# Altium schematic sheet Sensors_AFE1.schdoc: FR sensors
size 420 x 297 mm; EDA_Number: ARTIQ; Projet: KASLI 3U subsystem; CheckedBy: MK; Author: G.K.; CompanyName: CREOTECH; DrawnBy: G.K.; Organization: CTI SA; Address1: Creotech Instruments SA; Address2: Okulickiego 7/9, 05-500 Poland; Revision: -; SheetNumber: -; SheetTotal: -; ModifiedBy: -; CreateDate: XX/XX/XXXX; CheckedDate: -; DivGrp: CTI; Designer: G.K.; ModifiedDate: -; ProjectName: FMC DAC 100M 14B 16CHA ADC 2M 14B 4CHA
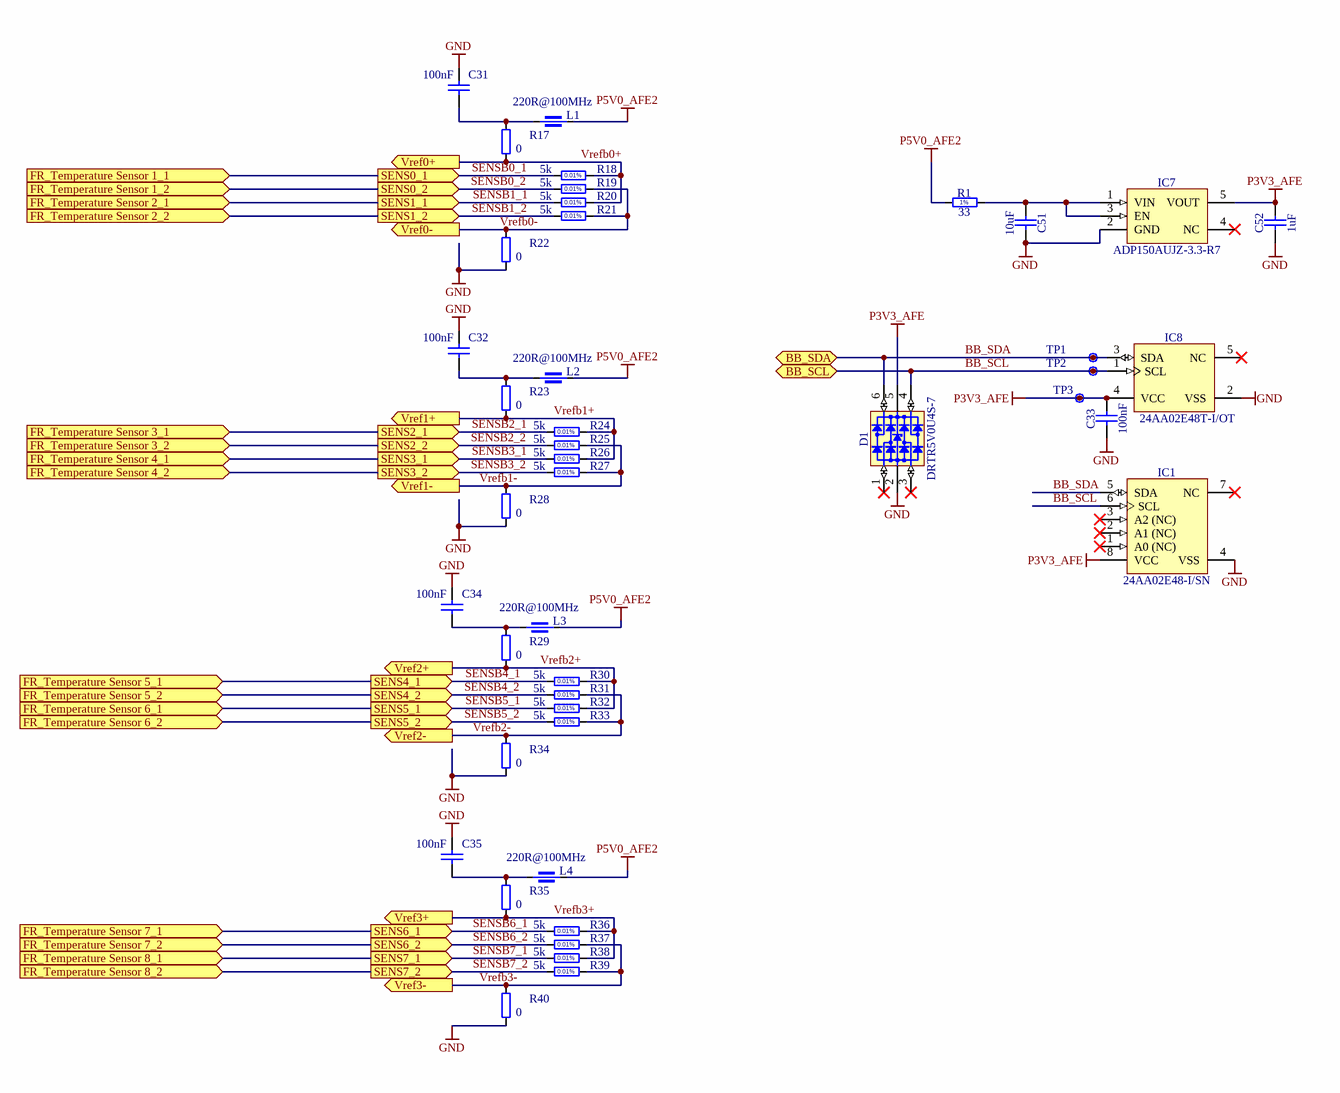
[diagram p0: Sensors_AFE1.schdoc]

## Parts
C31  100nF  [CAPC1005X55N]
C32  100nF  [CAPC1005X55N]
C33  100nF  [CAPC1005X55N]
C34  100nF  [CAPC1005X55N]
C35  100nF  [CAPC1005X55N]
C51  10uF  [CAPC2012X135N]
C52  1uF  [CAPC1608X87N]
D1  DRTR5V0U4S-7  [SOT65P210X110-6N]
IC1  24AA02E48-I/SN  [SOIC127P600X175-8N]
IC7  ADP150AUJZ-3.3-R7  [SOT95P280X90-5N]
IC8  24AA02E48T-I/OT  [SOT95P280X145-5N]
L1  220R@100MHz  [INDC1005X55N]
L2  220R@100MHz  [INDC1005X55N]
L3  220R@100MHz  [INDC1005X55N]
L4  220R@100MHz  [INDC1005X55N]
R1  33  [RESC1005X40N]
R17  0  [RESC1608X55N]
R18  5k  [RESC2013X64N]
R19  5k  [RESC2013X64N]
R20  5k  [RESC2013X64N]
R21  5k  [RESC2013X64N]
R22  0  [RESC1608X55N]
R23  0  [RESC1608X55N]
R24  5k  [RESC2013X64N]
R25  5k  [RESC2013X64N]
R26  5k  [RESC2013X64N]
R27  5k  [RESC2013X64N]
R28  0  [RESC1608X55N]
R29  0  [RESC1608X55N]
R30  5k  [RESC2013X64N]
R31  5k  [RESC2013X64N]
R32  5k  [RESC2013X64N]
R33  5k  [RESC2013X64N]
R34  0  [RESC1608X55N]
R35  0  [RESC1608X55N]
R36  5k  [RESC2013X64N]
R37  5k  [RESC2013X64N]
R38  5k  [RESC2013X64N]
R39  5k  [RESC2013X64N]
R40  0  [RESC1608X55N]
TP1  Test Point  [TPS127]  (value not drawn)
TP2  Test Point  [TPS127]  (value not drawn)
TP3  Test Point  [TPS127]  (value not drawn)

## Ports
BB_SCL (bidir), BB_SDA (bidir), FR_Temperature Sensor 1_1 (in), FR_Temperature Sensor 1_2 (in), FR_Temperature Sensor 2_1 (in), FR_Temperature Sensor 2_2 (in), FR_Temperature Sensor 3_1 (in), FR_Temperature Sensor 3_2 (in), FR_Temperature Sensor 4_1 (in), FR_Temperature Sensor 4_2 (in), FR_Temperature Sensor 5_1 (in), FR_Temperature Sensor 5_2 (in), FR_Temperature Sensor 6_1 (in), FR_Temperature Sensor 6_2 (in), FR_Temperature Sensor 7_1 (in), FR_Temperature Sensor 7_2 (in), FR_Temperature Sensor 8_1 (in), FR_Temperature Sensor 8_2 (in), SENS0_1 (out), SENS0_2 (out), SENS1_1 (out), SENS1_2 (out), SENS2_1 (out), SENS2_2 (out), SENS3_1 (out), SENS3_2 (out), SENS4_1 (out), SENS4_2 (out), SENS5_1 (out), SENS5_2 (out), SENS6_1 (out), SENS6_2 (out), SENS7_1 (out), SENS7_2 (out), Vref0+ (out), Vref0- (out), Vref1+ (out), Vref1- (out), Vref2+ (out), Vref2- (out), Vref3+ (out), Vref3- (out)

## Nets
GND: C31.1 C32.1 C33.1 C34.1 C35.1 C51.2 C52.1 D1.2(GND) IC1.4(VSS) IC7.2(GND) IC8.2(VSS) R22.1 R28.1 R34.1 R40.1
P3V3_AFE: C33.2 C52.2 D1.5(VBUS) IC1.8(VCC) IC7.5(VOUT) IC8.4(VCC) TP3.1
P5V0_AFE2: L1.2 L2.2 L3.2 L4.2 R1.1
BB_SCL: D1.4(I/O3) IC1.6(SCL) IC8.1(SCL) TP2.1 ; port BB_SCL
BB_SDA: D1.6(I/O4) IC1.5(SDA) IC8.3(SDA) TP1.1 ; port BB_SDA
SENSB0_1: R18.1 ; port SENS0_1, port FR_Temperature Sensor 1_1
SENSB0_2: R19.1 ; port SENS0_2, port FR_Temperature Sensor 1_2
SENSB1_1: R20.1 ; port SENS1_1, port FR_Temperature Sensor 2_1
SENSB1_2: R21.1 ; port SENS1_2, port FR_Temperature Sensor 2_2
SENSB2_1: R24.1 ; port SENS2_1, port FR_Temperature Sensor 3_1
SENSB2_2: R25.1 ; port SENS2_2, port FR_Temperature Sensor 3_2
SENSB3_1: R26.1 ; port SENS3_1, port FR_Temperature Sensor 4_1
SENSB3_2: R27.1 ; port SENS3_2, port FR_Temperature Sensor 4_2
SENSB4_1: R30.1 ; port SENS4_1, port FR_Temperature Sensor 5_1
SENSB4_2: R31.1 ; port SENS4_2, port FR_Temperature Sensor 5_2
SENSB5_1: R32.1 ; port SENS5_1, port FR_Temperature Sensor 6_1
SENSB5_2: R33.1 ; port SENS5_2, port FR_Temperature Sensor 6_2
SENSB6_1: R36.1 ; port SENS6_1, port FR_Temperature Sensor 7_1
SENSB6_2: R37.1 ; port SENS6_2, port FR_Temperature Sensor 7_2
SENSB7_1: R38.1 ; port SENS7_1, port FR_Temperature Sensor 8_1
SENSB7_2: R39.1 ; port SENS7_2, port FR_Temperature Sensor 8_2
Vrefb0+: R17.1 R18.2 R20.2 ; port Vref0+
Vrefb0-: R19.2 R21.2 R22.2 ; port Vref0-
Vrefb1+: R23.1 R24.2 R26.2 ; port Vref1+
Vrefb1-: R25.2 R27.2 R28.2 ; port Vref1-
Vrefb2+: R29.1 R30.2 R32.2 ; port Vref2+
Vrefb2-: R31.2 R33.2 R34.2 ; port Vref2-
Vrefb3+: R35.1 R36.2 R38.2 ; port Vref3+
Vrefb3-: R37.2 R39.2 R40.2 ; port Vref3-
NetC31_2: C31.2 L1.1 R17.2
NetC32_2: C32.2 L2.1 R23.2
NetC34_2: C34.2 L3.1 R29.2
NetC35_2: C35.2 L4.1 R35.2
NetC51_1: C51.1 IC7.1(VIN) IC7.3(EN) R1.2

Not connected (* = marked no-connect by the designer): D1 1(I/O1)* 3(I/O2)*; IC1 1(A0_(NC))* 2(A1_(NC))* 3(A2_(NC))* 7(NC)*; IC7 4(NC)*; IC8 5(NC)*

## Notes on the sheet
- Project/Equipment
- Document
- Designer
- Drawn by
- Check.by
- Copyright Creotech Instruments SA 2014.
  This documentation describes Open Hardware and is licensed under the CERN OHL v.1.1. You may redistribute and modify this documentation under the terms of the CERN OHL v.1.1. (http://ohwr.org/CERNOHL). This documentation is distributed WITHOUT ANY EXPRESS OR IMPLIED WARRANTY, INCLUDING OF MERCHANTABILITY, SATISFACTORY QUALITY AND FITNESS FOR A PARTICULAR PURPOSE. Please see the CERN OHL v.1.1 for applicable conditions.
- File
- Last Mod.
- Print Date
- Sheet
- Size
- A3
- of
- Rev
- (in symbol R0402_33R_1%_0.0625W_100PPM) 1%
- (in symbol R0805_5K_0.01%_0.2W_0.2PPM_VISHAY_VSMP) 0.01%

## Library data of the parts
C31-C35 = CC0402_100NF_16V_10%_X5R: Non-polarised capacitor; Part Description: SMD Multilayer Chip Ceramic Capacitor; Manufacturer: GENERIC; Manufacturer1 Part Number: GRM155R61C104KA88D; Voltage: 16V; TC: X5R; Tolerance: ±10%; Part Number: CC0402_100NF_16V_10%_X5R; Component Kind: Standard; Component Type: Standard; Pin Count: 2; Value: 100nF; Status: None; Manufacturer Part Number: CC0402_100NF_16V_10%_X5R; Case: 0402; Mounted: Yes; Socket: No; SMD: Yes; Sense: No; Manufacturer1 Example: MURATA; Manufacturer1 ComponentHeight: 0.55mm; HelpURL: \\cern.ch\dfs\Applications\Altium\Datasheets\CC0402_X5R_MURATA_GRM.pdf; Author: CERN DEM JLC; CreateDate: 10.12.2013; LatestRevisionDate: 10.12.2013
C51 = CC0805_10UF_16V_10%_X5R: Non-polarised capacitor; Part Description: SMD Multilayer Chip Ceramic Capacitor; Manufacturer: GENERIC; Manufacturer1 Part Number: C0805C106K4PAC; Voltage: 16V; TC: X5R; Tolerance: ±10%; Part Number: CC0805_10UF_16V_10%_X5R; Component Kind: Standard; Component Type: Standard; Pin Count: 2; Value: 10uF; Status: Preferred; Manufacturer Part Number: CC0805_10UF_16V_10%_X5R; Case: 0805; Mounted: Yes; Socket: No; SMD: Yes; Manufacturer1 Example: KEMET; Manufacturer1 ComponentHeight: 1.4mm; HelpURL: \\cern.ch\dfs\Applications\Altium\Datasheets\CC1206_X5R_KEMET.pdf; Author: CERN DEM JLC; CreateDate: 03.12.2007; LatestRevisionDate: 03.12.2007; Sense: No
C52 = CC0603_1UF_25V_10%_X7R: Non-polarised capacitor; Part Description: SMD Multilayer Chip Ceramic Capacitor; Manufacturer: GENERIC; Manufacturer1 Part Number: GRM188R71E105KA12D; Voltage: 25V; TC: X7R; Tolerance: ±10%; Part Number: CC0603_1UF_25V_10%_X7R; Component Kind: Standard; Component Type: Standard; Pin Count: 2; Value: 1uF; Status: None; Manufacturer Part Number: CC0603_1UF_25V_10%_X7R; Case: 0603; Mounted: Yes; Socket: No; SMD: Yes; Sense: No; Manufacturer1 Example: MURATA; Manufacturer1 ComponentHeight: 0.9mm; HelpURL: \\cern.ch\dfs\Applications\Altium\Datasheets\CC0603_X7R_MURATA.pdf; Author: CERN DEM JLC; CreateDate: 18/01/2011; LatestRevisionDate: 18/01/2011
D1 = D_TVS_DRTR5V0U4S-7: Integrated Quad Ultra-Low Capacitance ESD Protection; Part Description: Integrated Quad Ultra-Low Capacitance ESD (±8kV) Protection; Manufacturer: DIODES; PressFit: No; Bonding: No; Status Comment: Active; Part Number: DRTR5V0U4S-7; Component Kind: Standard; Component Type: Standard; Device: DRTR5V0U4S-7; PackageDescription: SOT363, SC70-6, 0.65mm Pitch; 6 Pin, 1.25mm W X 2.00mm L X 1.10mm H body, IPC Medium Density; Status: Active; Manufacturer Part Number: DRTR5V0U4S-7; Pin Count: 6; Case: SOT363; Mounted: Yes; Socket: No; SMD: Yes; Sense: No; ComponentHeight: 1.1mm; HelpURL: \\cern.ch\dfs\Applications\Altium\Datasheets\PRTR5V0U4Y.pdf; Author: GK; CreateDate: 24.01.2017; LatestRevisionDate: 14.09.2020
IC1 = MEM_24AA02E48-I/SN: 1.7V-5.5V, 2K I2C™ Serial EEPROMs with EUI-48™ Node Identity; Manufacturer: MICROCHIP TECHNOLOGY; PressFit: No; Bonding: No; Part Number: 24AA02E48-I/SN; Component Kind: Standard; Component Type: Standard; Device: 24AA02E48-I/SN; PackageDescription: SOIC, 1.27mm Pitch; 8 Pin - Body 4x5mm, IPC Medium Density; Part Description: 1.7V-5.5V, 2K I2C™ Serial EEPROMs with EUI-48™ Node Identity; Manufacturer Part Number: 24AA02E48-I/SN; Pin Count: 8; Case: SOIC8; Mounted: Yes; Socket: No; SMD: Yes; Sense: No; ComponentHeight: 1.75mm; HelpURL: \\cern.ch\dfs\Applications\Altium\Datasheets\24AA025E48-I-SN.pdf; Author: CERN DEM MR; CreateDate: 19.07.2016; LatestRevisionDate: 19.07.2016
IC7 = ADP150AUJZ-3.3-R7: Ultralow Noise, 150 mA CMOS Linear Regulator; Part Description: 3.3V, 150mA, Ultralow Noise, CMOS Linear Regulator; Manufacturer: ANALOG DEVICES; PressFit: No; Bonding: No; Part Number: ADP150AUJZ-3.3-R7; Component Kind: Standard; Component Type: Standard; Device: ADP150AUJZ-3.3-R7; PackageDescription: SOT23, 0.95mm pitch; 5 pin, 1.75mm W X 3.00mm L, IPC Medium Density; Manufacturer Part Number: ADP150AUJZ-3.3-R7; Pin Count: 5; Case: SOT23; Mounted: Yes; Socket: No; SMD: Yes; Sense: No; ComponentHeight: 0.9mm; HelpURL: \\cern.ch\dfs\Applications\Altium\Datasheets\ADP150AUJZ-3.3-R7.pdf; Author: CERN DEM JLC; CreateDate: 27/09/2011; LatestRevisionDate: 19/06/2014
IC8 = 24AA02E48T-I/OT: 1.7V-5.5V, 2K I2C Serial EEPROM With EUI-48 Node Identity; Manufacturer: MICROCHIP TECHNOLOGY; PressFit: No; Bonding: No; Part Number: 24AA02E48T-I/OT; Component Kind: Standard; Component Type: Standard; Device: 24AA02E48T-I/OT; PackageDescription: SOT, 0.95mm pitch; 5 pin, 1.60mm W X 2.90mm L X 1.45mm H body, IPC Medium Density; Part Description: 1.7V-5.5V, 2K I2C Serial EEPROM With EUI-48 Node Identity; Manufacturer Part Number: 24AA02E48T-I/OT; Pin Count: 5; Case: SOT23-5; Mounted: Yes; Socket: No; SMD: Yes; Sense: No; ComponentHeight: 1.45mm; HelpURL: \\cern.ch\dfs\Applications\Altium\Datasheets\24AA02E48T-I-OT.pdf; Author: CERN DEM MR; CreateDate: 31.03.2016; LatestRevisionDate: 31.03.2016
L1-L4 = IND0402_MURATA_BLM15HB221SN1: Part Description: SMD EMIFIL Suppression Chip Ferrite Bead; Manufacturer: MURATA; Power: 250mA; Resistance: 1R; Tolerance: ±25%; Part Number: IND0402_MURATA_BLM15HB221SN1; Component Kind: Standard; Component Type: Standard; Pin Count: 2; Value: 220R@100MHz; Status: None; Manufacturer Part Number: BLM15HB221SN1; Case: 0402; Mounted: Yes; Socket: No; SMD: Yes; Sense: No; ComponentHeight: 0.55mm; HelpURL: \\cern.ch\dfs\Applications\Altium\Datasheets\IND0402_MURATA_BLM15H.pdf; Author: CERN DEM JLC; CreateDate: 23.06.2009; LatestRevisionDate: 25.10.2018
R1 = R0402_33R_1%_0.0625W_100PPM: Resistor - 1%; Part Description: General Purpose Thick Film Chip Resistor; Manufacturer: GENERIC; Manufacturer1 Part Number: 232270673309L; TC: ±100ppm/°C; PressFit: No; Part Number: R0402_33R_1%_0.0625W_100PPM; Component Kind: Standard; Component Type: Standard; Pin Count: 2; Value: 33; Status: Not Recommended; Power: 0.0625W; Tolerance: ±1%; Manufacturer Part Number: R0402_33R_1%_0.0625W_100PPM; Case: 0402; Mounted: Yes; Sense: No; Socket: No; SMD: Yes; Manufacturer1 Example: YAGEO PHYCOMP; Manufacturer1 ComponentHeight: 0.4mm; HelpURL: \\cern.ch\dfs\Applications\Altium\Datasheets\R0402_Phycomp_RC0402.pdf; Author: CERN DEM JLC; CreateDate: 03/12/2007; LatestRevisionDate: 17/10/2012
R17 R22 R23 R28 R29 R34 R35 R40 = R0603_0R_JUMPER: Resistor; Part Description: 1A (0.05R Max DC Resistance) Zero Ohm Jumper; Manufacturer: GENERIC; Manufacturer1 Part Number: NRC06Z0; PressFit: No; Part Number: R0603_0R_JUMPER; Component Kind: Standard; Component Type: Standard; Pin Count: 2; Value: 0; Status: Preferred; Manufacturer Part Number: R0603_0R_JUMPER; Case: 0603; Mounted: Yes; Sense: No; Socket: No; SMD: Yes; Manufacturer1 Example: NIC COMPONENT; Manufacturer1 ComponentHeight: 0.55mm; HelpURL: \\cern.ch\dfs\Applications\Altium\Datasheets\R0603_NIC_NRC.pdf; Author: CERN DEM JLC; CreateDate: 03.12.2007; LatestRevisionDate: 13.03.2008
R18-R21 R24-R27 R30-R33 R36-R39 = R0805_5K_0.01%_0.2W_0.2PPM_VISHAY_VSMP: Resistor - 0.01%; Part Description: Ultra High Precision Foil Wraparound Surface Mount Chip Resistor; Manufacturer: VISHAY PRECISION; Manufacturer Part Number: Y16245K00000T9R; Power: 0.2W; TC: ±0.2ppm/°C; PressFit: No; Part Number: R0805_5K_0.01%_0.2W_0.2PPM_VISHAY_VSMP; Component Kind: Standard; Component Type: Standard; Pin Count: 2; Value: 5k; Status: None; Tolerance: ±0.01%; Case: 0805; Mounted: Yes; Sense: No; Socket: No; SMD: Yes; Manufacturer1 ComponentHeight: 0.64mm; HelpURL: \\cern.ch\dfs\Applications\Altium\Datasheets\R0805_VISHAY_VSMP.pdf; Author: CERN DEM JLC; CreateDate: 22.09.2011; LatestRevisionDate: 22.09.2011
TP1-TP3 = SMD_PAD_1.27X1.27MM: Part Description: 1.27mm x 1.27mm PCB Copper Area (SMD Test Point); Mounted: No; Part Number: SMD_PAD_1.27X1.27MM; Component Kind: Standard (No BOM); Component Type: Standard (No BOM); Pin Count: 1; Family: Test Point; Socket: No; SMD: Yes; Sense: No; Status: None; ComponentHeight: 0mm; HelpURL: Undefined; Author: CERN DEM JLC; CreateDate: 12.01.2008; LatestRevisionDate: 12.01.2008; PackageDescription: 1.27mm x 1.27mm PCB Copper Area (SMD Test Point)